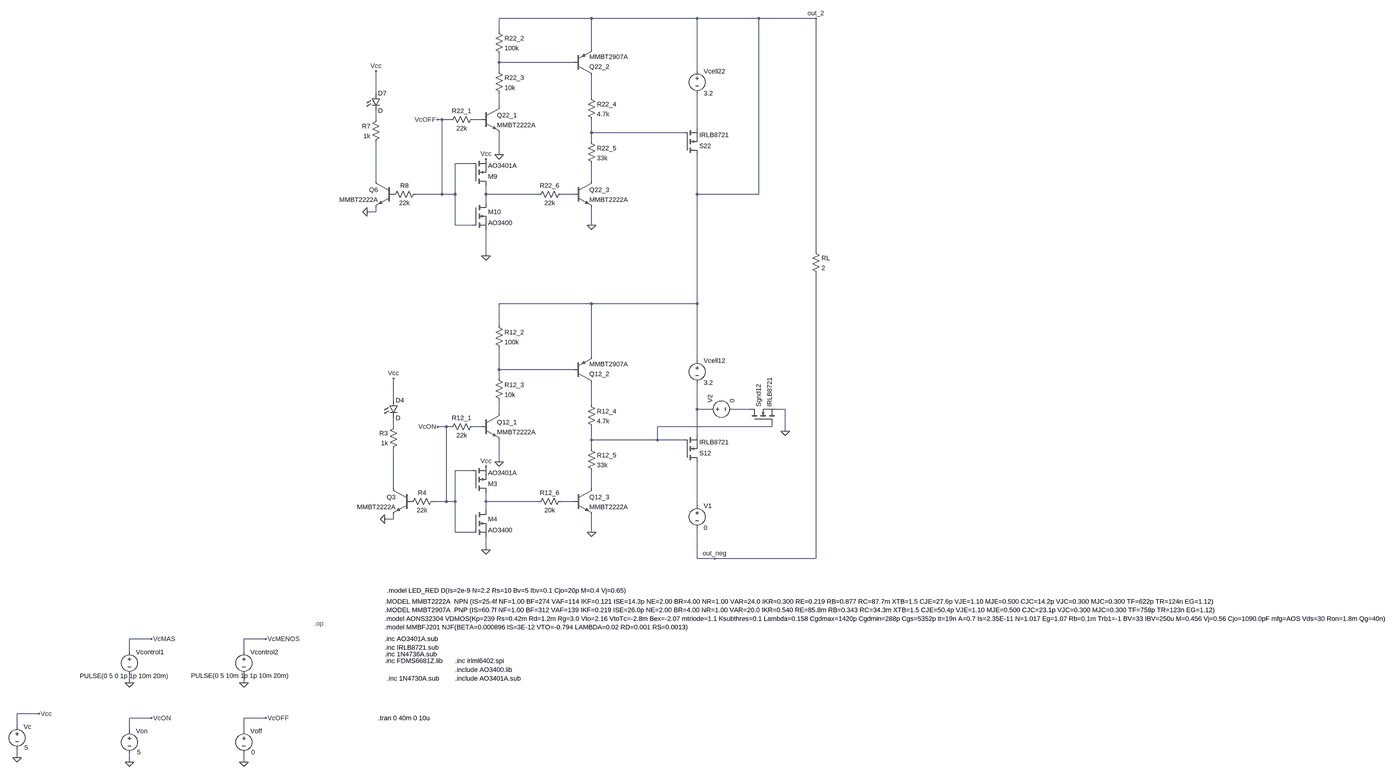
[diagram p0: schematic Pruebas de funcionamiento celdas - Bypass manual.asc, whole sheet]
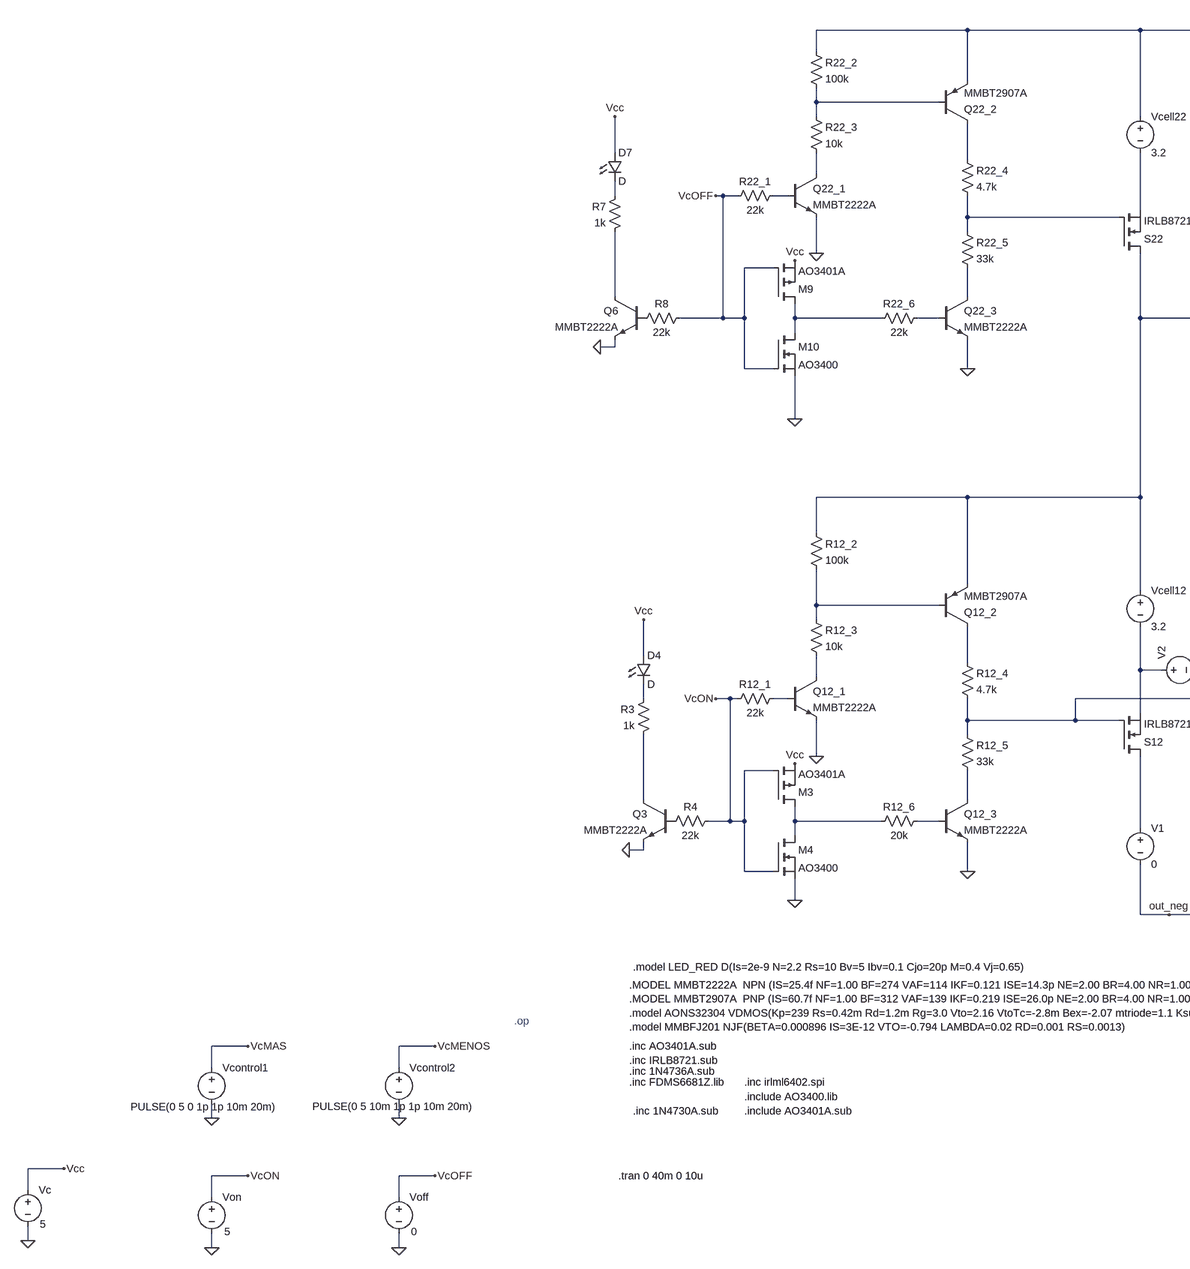
[diagram p1: schematic Pruebas de funcionamiento celdas - Bypass manual.asc, part, row 1 of 1, column 1 of 2]
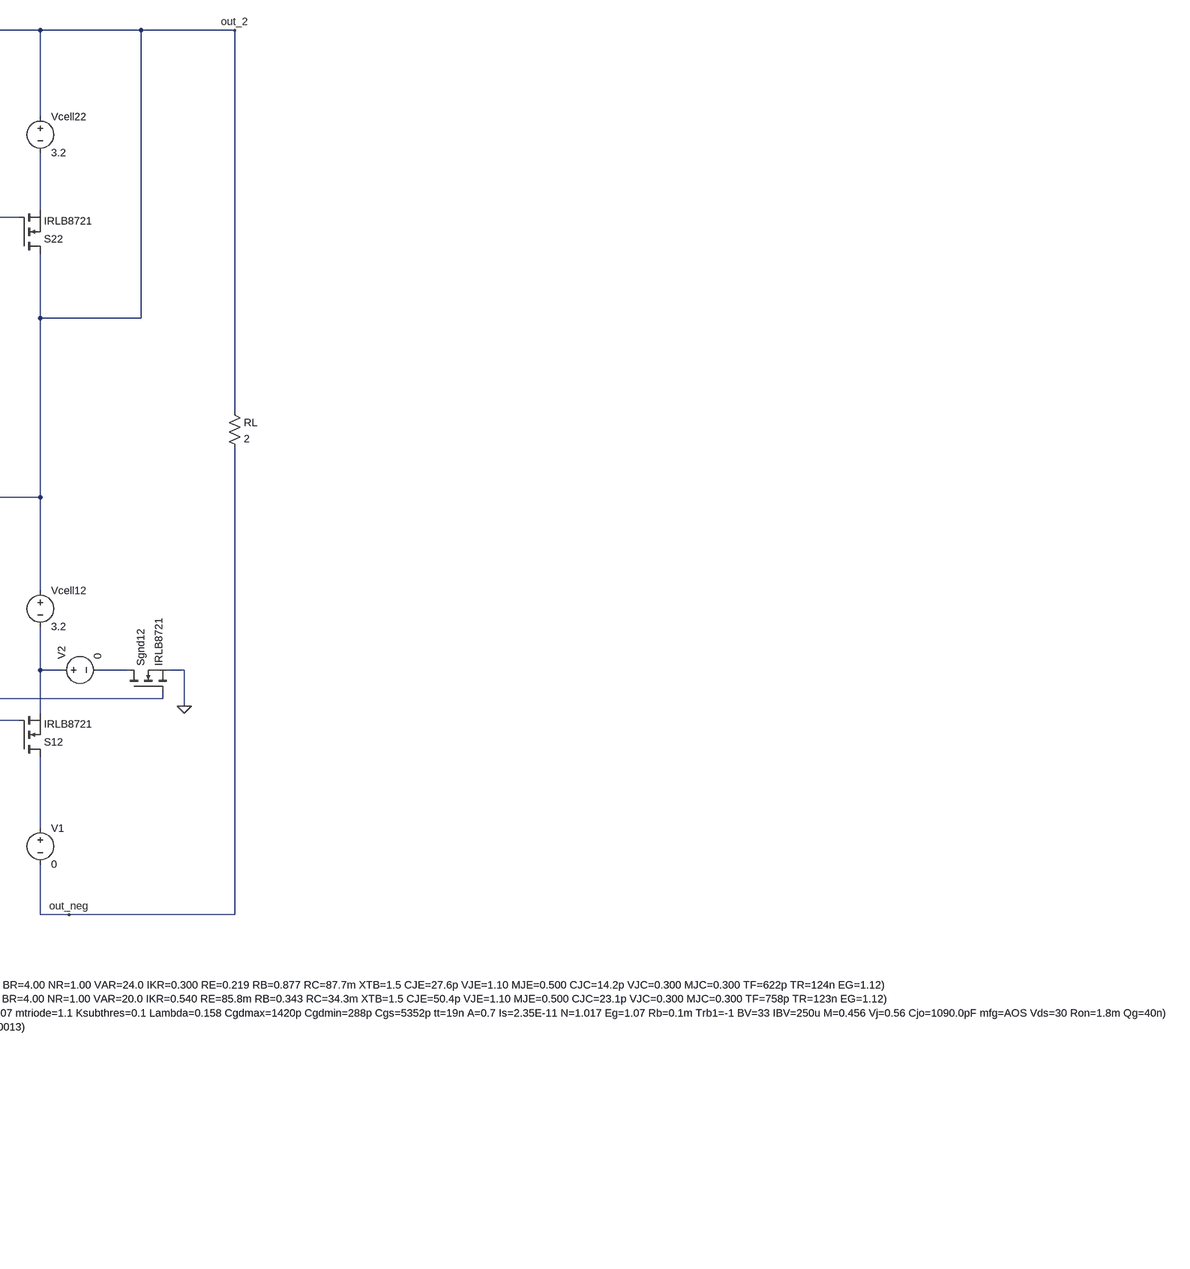
[diagram p2: schematic Pruebas de funcionamiento celdas - Bypass manual.asc, part, row 1 of 1, column 2 of 2]
Pruebas de funcionamiento celdas - Bypass manual.asc, the LTspice schematic file:
Version 4.1
SHEET 1 7672 2128
WIRE 528 -1456 192 -1456
WIRE 912 -1456 528 -1456
WIRE 1136 -1456 912 -1456
WIRE 1344 -1456 1136 -1456
WIRE 192 -1408 192 -1456
WIRE 528 -1344 528 -1456
WIRE 192 -1296 192 -1328
WIRE 464 -1296 192 -1296
WIRE 192 -1264 192 -1296
WIRE 912 -1264 912 -1456
WIRE -256 -1184 -256 -1264
WIRE 528 -1168 528 -1248
WIRE 192 -1136 192 -1184
WIRE -256 -1088 -256 -1120
WIRE -16 -1088 -32 -1088
WIRE 16 -1088 -16 -1088
WIRE 128 -1088 96 -1088
WIRE 912 -1056 912 -1184
WIRE 528 -1040 528 -1088
WIRE 864 -1040 528 -1040
WIRE 528 -1008 528 -1040
WIRE 192 -960 192 -1040
WIRE 96 -928 32 -928
WIRE -256 -864 -256 -1008
WIRE 528 -864 528 -928
WIRE -16 -816 -16 -1088
WIRE -16 -816 -112 -816
WIRE 32 -816 32 -928
WIRE 32 -816 -16 -816
WIRE 144 -816 144 -848
WIRE 336 -816 144 -816
WIRE 464 -816 416 -816
WIRE 912 -816 912 -960
WIRE 1136 -816 1136 -1456
WIRE 1136 -816 912 -816
WIRE 144 -784 144 -816
WIRE -256 -752 -256 -768
WIRE -256 -752 -288 -752
WIRE 32 -704 32 -816
WIRE 96 -704 32 -704
WIRE 528 -704 528 -768
WIRE 1344 -608 1344 -1456
WIRE 144 -592 144 -688
WIRE 528 -368 192 -368
WIRE 912 -368 912 -816
WIRE 912 -368 528 -368
WIRE 192 -288 192 -368
WIRE 528 -176 528 -368
WIRE 912 -160 912 -368
WIRE 192 -128 192 -208
WIRE 464 -128 192 -128
WIRE 192 -96 192 -128
WIRE -192 -16 -192 -96
WIRE 528 0 528 -80
WIRE 912 16 912 -80
WIRE 960 16 912 16
WIRE 1104 16 1040 16
WIRE 1232 16 1200 16
WIRE 192 32 192 -16
WIRE -192 80 -192 48
WIRE 0 80 -32 80
WIRE 16 80 0 80
WIRE 128 80 96 80
WIRE 1184 80 1184 64
WIRE 1184 80 768 80
WIRE 1232 96 1232 16
WIRE 912 112 912 16
WIRE 528 128 528 80
WIRE 768 128 768 80
WIRE 768 128 528 128
WIRE 864 128 768 128
WIRE 528 160 528 128
WIRE 192 208 192 128
WIRE 96 240 32 240
WIRE -192 304 -192 160
WIRE 528 304 528 240
WIRE 0 352 0 80
WIRE 0 352 -48 352
WIRE 32 352 32 240
WIRE 32 352 0 352
WIRE 144 352 144 320
WIRE 336 352 144 352
WIRE 464 352 416 352
WIRE 912 368 912 208
WIRE 144 384 144 352
WIRE -192 416 -192 400
WIRE -192 416 -224 416
WIRE 32 464 32 352
WIRE 96 464 32 464
WIRE 528 464 528 400
WIRE 144 528 144 480
WIRE 912 560 912 448
WIRE 976 560 912 560
WIRE 1344 560 1344 -528
WIRE 1344 560 976 560
WIRE -1072 1024 -1152 1024
WIRE -656 1024 -736 1024
WIRE -1152 1072 -1152 1024
WIRE -736 1072 -736 1024
WIRE -1152 1184 -1152 1152
WIRE -736 1184 -736 1152
WIRE -1504 1296 -1584 1296
WIRE -1072 1312 -1152 1312
WIRE -656 1312 -736 1312
WIRE -1584 1344 -1584 1296
WIRE -1152 1360 -1152 1312
WIRE -736 1360 -736 1312
WIRE -1584 1456 -1584 1424
WIRE -1152 1472 -1152 1440
WIRE -736 1472 -736 1440
FLAG 192 208 0
FLAG 528 464 0
FLAG 192 -960 0
FLAG 528 -704 0
FLAG -1152 1184 0
FLAG -736 1184 0
FLAG -1072 1024 VcMAS
FLAG -656 1024 VcMENOS
FLAG -736 1472 0
FLAG -656 1312 VcOFF
FLAG -1152 1472 0
FLAG -1072 1312 VcON
FLAG -32 -1088 VcOFF
FLAG -32 80 VcON
FLAG 976 560 out_neg
FLAG 1232 96 0
FLAG 1344 -1456 out_2
FLAG -224 416 0
FLAG -288 -752 0
FLAG -192 -96 Vcc
FLAG -256 -1264 Vcc
FLAG -1584 1456 0
FLAG -1504 1296 Vcc
FLAG 144 528 0
FLAG 144 224 Vcc
FLAG 144 -592 0
FLAG 144 -944 Vcc
SYMBOL npn 464 304 R0
SYMATTR InstName Q12_3
SYMATTR Value MMBT2222A
SYMBOL res 512 144 R0
SYMATTR InstName R12_5
SYMATTR Value 33k
SYMBOL res 512 -16 R0
SYMATTR InstName R12_4
SYMATTR Value 4.7k
SYMBOL npn 128 32 R0
SYMATTR InstName Q12_1
SYMATTR Value MMBT2222A
SYMBOL res 176 -112 R0
SYMATTR InstName R12_3
SYMATTR Value 10k
SYMBOL res 176 -304 R0
SYMATTR InstName R12_2
SYMATTR Value 100k
SYMBOL res 432 336 R90
WINDOW 0 0 56 VBottom 2
WINDOW 3 32 56 VTop 2
SYMATTR InstName R12_6
SYMATTR Value 20k
SYMBOL voltage 912 -176 R0
WINDOW 123 0 0 Left 0
WINDOW 39 0 0 Left 0
SYMATTR InstName Vcell12
SYMATTR Value 3.2
SYMBOL pnp 464 -80 M180
SYMATTR InstName Q12_2
SYMATTR Value MMBT2907A
SYMBOL nmos 864 208 M180
SYMATTR InstName S12
SYMATTR Value IRLB8721
SYMATTR Prefix X
SYMBOL npn 464 -864 R0
SYMATTR InstName Q22_3
SYMATTR Value MMBT2222A
SYMBOL res 512 -1024 R0
SYMATTR InstName R22_5
SYMATTR Value 33k
SYMBOL res 512 -1184 R0
SYMATTR InstName R22_4
SYMATTR Value 4.7k
SYMBOL npn 128 -1136 R0
SYMATTR InstName Q22_1
SYMATTR Value MMBT2222A
SYMBOL res 176 -1280 R0
SYMATTR InstName R22_3
SYMATTR Value 10k
SYMBOL res 176 -1424 R0
SYMATTR InstName R22_2
SYMATTR Value 100k
SYMBOL res 432 -832 R90
WINDOW 0 0 56 VBottom 2
WINDOW 3 32 56 VTop 2
SYMATTR InstName R22_6
SYMATTR Value 22k
SYMBOL voltage 912 -1280 R0
WINDOW 123 0 0 Left 0
WINDOW 39 0 0 Left 0
SYMATTR InstName Vcell22
SYMATTR Value 3.2
SYMBOL pnp 464 -1248 M180
SYMATTR InstName Q22_2
SYMATTR Value MMBT2907A
SYMBOL nmos 864 -960 M180
SYMATTR InstName S22
SYMATTR Value IRLB8721
SYMATTR Prefix X
SYMBOL voltage -1152 1056 R0
WINDOW 3 -180 103 Left 2
WINDOW 123 0 0 Left 0
WINDOW 39 0 0 Left 0
SYMATTR Value PULSE(0 5 0 1p 1p 10m 20m)
SYMATTR InstName Vcontrol1
SYMBOL voltage -736 1056 R0
WINDOW 3 -192 102 Left 2
WINDOW 123 0 0 Left 0
WINDOW 39 0 0 Left 0
SYMATTR Value PULSE(0 5 10m 1p 1p 10m 20m)
SYMATTR InstName Vcontrol2
SYMBOL voltage -736 1344 R0
WINDOW 3 27 92 Left 2
WINDOW 123 0 0 Left 0
WINDOW 39 0 0 Left 0
SYMATTR Value 0
SYMATTR InstName Voff
SYMBOL voltage -1152 1344 R0
WINDOW 3 28 92 Left 2
WINDOW 123 0 0 Left 0
WINDOW 39 0 0 Left 0
SYMATTR Value 5
SYMATTR InstName Von
SYMBOL res 112 -1104 R90
WINDOW 0 0 56 VBottom 2
WINDOW 3 32 56 VTop 2
SYMATTR InstName R22_1
SYMATTR Value 22k
SYMBOL res 112 64 R90
WINDOW 0 0 56 VBottom 2
WINDOW 3 32 56 VTop 2
SYMATTR InstName R12_1
SYMATTR Value 22k
SYMBOL nmos 1104 64 R270
SYMATTR InstName Sgnd12
SYMATTR Value IRLB8721
SYMATTR Prefix X
SYMBOL voltage 912 352 R0
WINDOW 123 0 0 Left 0
WINDOW 39 0 0 Left 0
SYMATTR InstName V1
SYMATTR Value 0
SYMBOL npn -128 304 M0
SYMATTR InstName Q3
SYMATTR Value MMBT2222A
SYMBOL res -176 64 M0
SYMATTR InstName R3
SYMATTR Value 1k
SYMBOL res -32 336 R90
WINDOW 0 0 56 VBottom 2
WINDOW 3 32 56 VTop 2
SYMATTR InstName R4
SYMATTR Value 22k
SYMBOL LED -208 -16 R0
SYMATTR InstName D4
SYMBOL npn -192 -864 M0
SYMATTR InstName Q6
SYMATTR Value MMBT2222A
SYMBOL res -240 -1104 M0
SYMATTR InstName R7
SYMATTR Value 1k
SYMBOL res -96 -832 R90
WINDOW 0 0 56 VBottom 2
WINDOW 3 32 56 VTop 2
SYMATTR InstName R8
SYMATTR Value 22k
SYMBOL LED -272 -1184 R0
SYMATTR InstName D7
SYMBOL res 1328 -624 R0
SYMATTR InstName RL
SYMATTR Value 2
SYMBOL voltage -1584 1328 R0
WINDOW 3 27 92 Left 2
WINDOW 123 0 0 Left 0
WINDOW 39 0 0 Left 0
SYMATTR Value 5
SYMATTR InstName Vc
SYMBOL pmos 96 320 M180
SYMATTR InstName M3
SYMATTR Value AO3401A
SYMATTR Prefix X
SYMBOL nmos 96 384 R0
SYMATTR InstName M4
SYMATTR Value AO3400
SYMATTR Prefix X
SYMBOL pmos 96 -848 M180
SYMATTR InstName M9
SYMATTR Value AO3401A
SYMATTR Prefix X
SYMBOL nmos 96 -784 R0
SYMATTR InstName M10
SYMATTR Value AO3400
SYMATTR Prefix X
SYMBOL voltage 944 16 R270
WINDOW 123 0 0 Left 0
WINDOW 39 0 0 Left 0
SYMATTR InstName V2
SYMATTR Value 0
TEXT -248 1312 Left 2 !.tran 0 40m 0 10u
TEXT -224 888 Left 2 !.MODEL MMBT2222A  NPN (IS=25.4f NF=1.00 BF=274 VAF=114 IKF=0.121 ISE=14.3p NE=2.00 BR=4.00 NR=1.00 VAR=24.0 IKR=0.300 RE=0.219 RB=0.877 RC=87.7m XTB=1.5 CJE=27.6p VJE=1.10 MJE=0.500 CJC=14.2p VJC=0.300 MJC=0.300 TF=622p TR=124n EG=1.12)\n.MODEL MMBT2907A  PNP (IS=60.7f NF=1.00 BF=312 VAF=139 IKF=0.219 ISE=26.0p NE=2.00 BR=4.00 NR=1.00 VAR=20.0 IKR=0.540 RE=85.8m RB=0.343 RC=34.3m XTB=1.5 CJE=50.4p VJE=1.10 MJE=0.500 CJC=23.1p VJC=0.300 MJC=0.300 TF=758p TR=123n EG=1.12)\n.model AONS32304 VDMOS(Kp=239 Rs=0.42m Rd=1.2m Rg=3.0 Vto=2.16 VtoTc=-2.8m Bex=-2.07 mtriode=1.1 Ksubthres=0.1 Lambda=0.158 Cgdmax=1420p Cgdmin=288p Cgs=5352p tt=19n A=0.7 Is=2.35E-11 N=1.017 Eg=1.07 Rb=0.1m Trb1=-1 BV=33 IBV=250u M=0.456 Vj=0.56 Cjo=1090.0pF mfg=AOS Vds=30 Ron=1.8m Qg=40n)\n.model MMBFJ201 NJF(BETA=0.000896 IS=3E-12 VTO=-0.794 LAMBDA=0.02 RD=0.001 RS=0.0013)
TEXT -224 1024 Left 2 !.inc AO3401A.sub\n.inc IRLB8721.sub
TEXT -224 1080 Left 2 !.inc 1N4736A.sub
TEXT -224 1104 Left 2 !.inc FDMS6681Z.lib
TEXT -216 1168 Left 2 !.inc 1N4730A.sub
TEXT -216 848 Left 2 !.model LED_RED D(Is=2e-9 N=2.2 Rs=10 Bv=5 Ibv=0.1 Cjo=20p M=0.4 Vj=0.65)
TEXT 32 1104 Left 2 !.inc irlml6402.spi
TEXT 32 1136 Left 2 !.include AO3400.lib
TEXT 32 1168 Left 2 !.include AO3401A.sub
TEXT -480 968 Left 2 ;.op

The netlist it stands for:
* Pruebas de funcionamiento celdas - Bypass manual.asc
Q12_3 N021 N023 0 0 MMBT2222A
R12_5 N019 N021 33k
R12_4 N013 N019 4.7k
Q12_1 N016 N018 0 0 MMBT2222A
R12_3 N012 N016 10k
R12_2 out_2 N012 100k
R12_6 N023 N022 20k
Vcell12 out_2 N014 3.2
Q12_2 N013 N012 out_2 0 MMBT2907A
X§S12 N024 N019 N014 IRLB8721  ; pins D G S
Q22_3 N009 N011 0 0 MMBT2222A
R22_5 N007 N009 33k
R22_4 N002 N007 4.7k
Q22_1 N003 N005 0 0 MMBT2222A
R22_3 N001 N003 10k
R22_2 out_2 N001 100k
R22_6 N011 N010 22k
Vcell22 out_2 N006 3.2
Q22_2 N002 N001 out_2 0 MMBT2907A
X§S22 out_2 N007 N006 IRLB8721  ; pins D G S
Vcontrol1 VcMAS 0 PULSE(0 5 0 1p 1p 10m 20m)
Vcontrol2 VcMENOS 0 PULSE(0 5 10m 1p 1p 10m 20m)
Voff VcOFF 0 0
Von VcON 0 5
R22_1 N005 VcOFF 22k
R12_1 N018 VcON 22k
X§Sgnd12 N015 N019 0 IRLB8721  ; pins D G S
V1 N024 out_neg 0
Q3 N020 P001 0 0 MMBT2222A
R3 N017 N020 1k
R4 VcON P001 22k
D4 Vcc N017 D
Q6 N008 P002 0 0 MMBT2222A
R7 N004 N008 1k
R8 VcOFF P002 22k
D7 Vcc N004 D
RL out_2 out_neg 2
Vc Vcc 0 5
X§M3 N022 VcON Vcc AO3401A  ; pins D G S
X§M4 N022 VcON 0 AO3400  ; pins D G S
X§M9 N010 VcOFF Vcc AO3401A  ; pins D G S
X§M10 N010 VcOFF 0 AO3400  ; pins D G S
V2 N014 N015 0
.model D D
.lib standard.dio
.model NPN NPN
.model PNP PNP
.lib standard.bjt
.tran 0 40m 0 10u
.MODEL MMBT2222A  NPN (IS=25.4f NF=1.00 BF=274 VAF=114 IKF=0.121 ISE=14.3p NE=2.00 BR=4.00 NR=1.00 VAR=24.0 IKR=0.300 RE=0.219 RB=0.877 RC=87.7m XTB=1.5 CJE=27.6p VJE=1.10 MJE=0.500 CJC=14.2p VJC=0.300 MJC=0.300 TF=622p TR=124n EG=1.12)
.MODEL MMBT2907A  PNP (IS=60.7f NF=1.00 BF=312 VAF=139 IKF=0.219 ISE=26.0p NE=2.00 BR=4.00 NR=1.00 VAR=20.0 IKR=0.540 RE=85.8m RB=0.343 RC=34.3m XTB=1.5 CJE=50.4p VJE=1.10 MJE=0.500 CJC=23.1p VJC=0.300 MJC=0.300 TF=758p TR=123n EG=1.12)
.model AONS32304 VDMOS(Kp=239 Rs=0.42m Rd=1.2m Rg=3.0 Vto=2.16 VtoTc=-2.8m Bex=-2.07 mtriode=1.1 Ksubthres=0.1 Lambda=0.158 Cgdmax=1420p Cgdmin=288p Cgs=5352p tt=19n A=0.7 Is=2.35E-11 N=1.017 Eg=1.07 Rb=0.1m Trb1=-1 BV=33 IBV=250u M=0.456 Vj=0.56 Cjo=1090.0pF mfg=AOS Vds=30 Ron=1.8m Qg=40n)
.model MMBFJ201 NJF(BETA=0.000896 IS=3E-12 VTO=-0.794 LAMBDA=0.02 RD=0.001 RS=0.0013)
.inc AO3401A.sub
.inc IRLB8721.sub
.inc 1N4736A.sub
.inc FDMS6681Z.lib
.inc 1N4730A.sub
.model LED_RED D(Is=2e-9 N=2.2 Rs=10 Bv=5 Ibv=0.1 Cjo=20p M=0.4 Vj=0.65)
.inc irlml6402.spi
.include AO3400.lib
.include AO3401A.sub
* .op
.backanno
.end